# EAGLE design ELEKTRA-BENCH v0.1-20240103 (EAGLE 9.6.2)
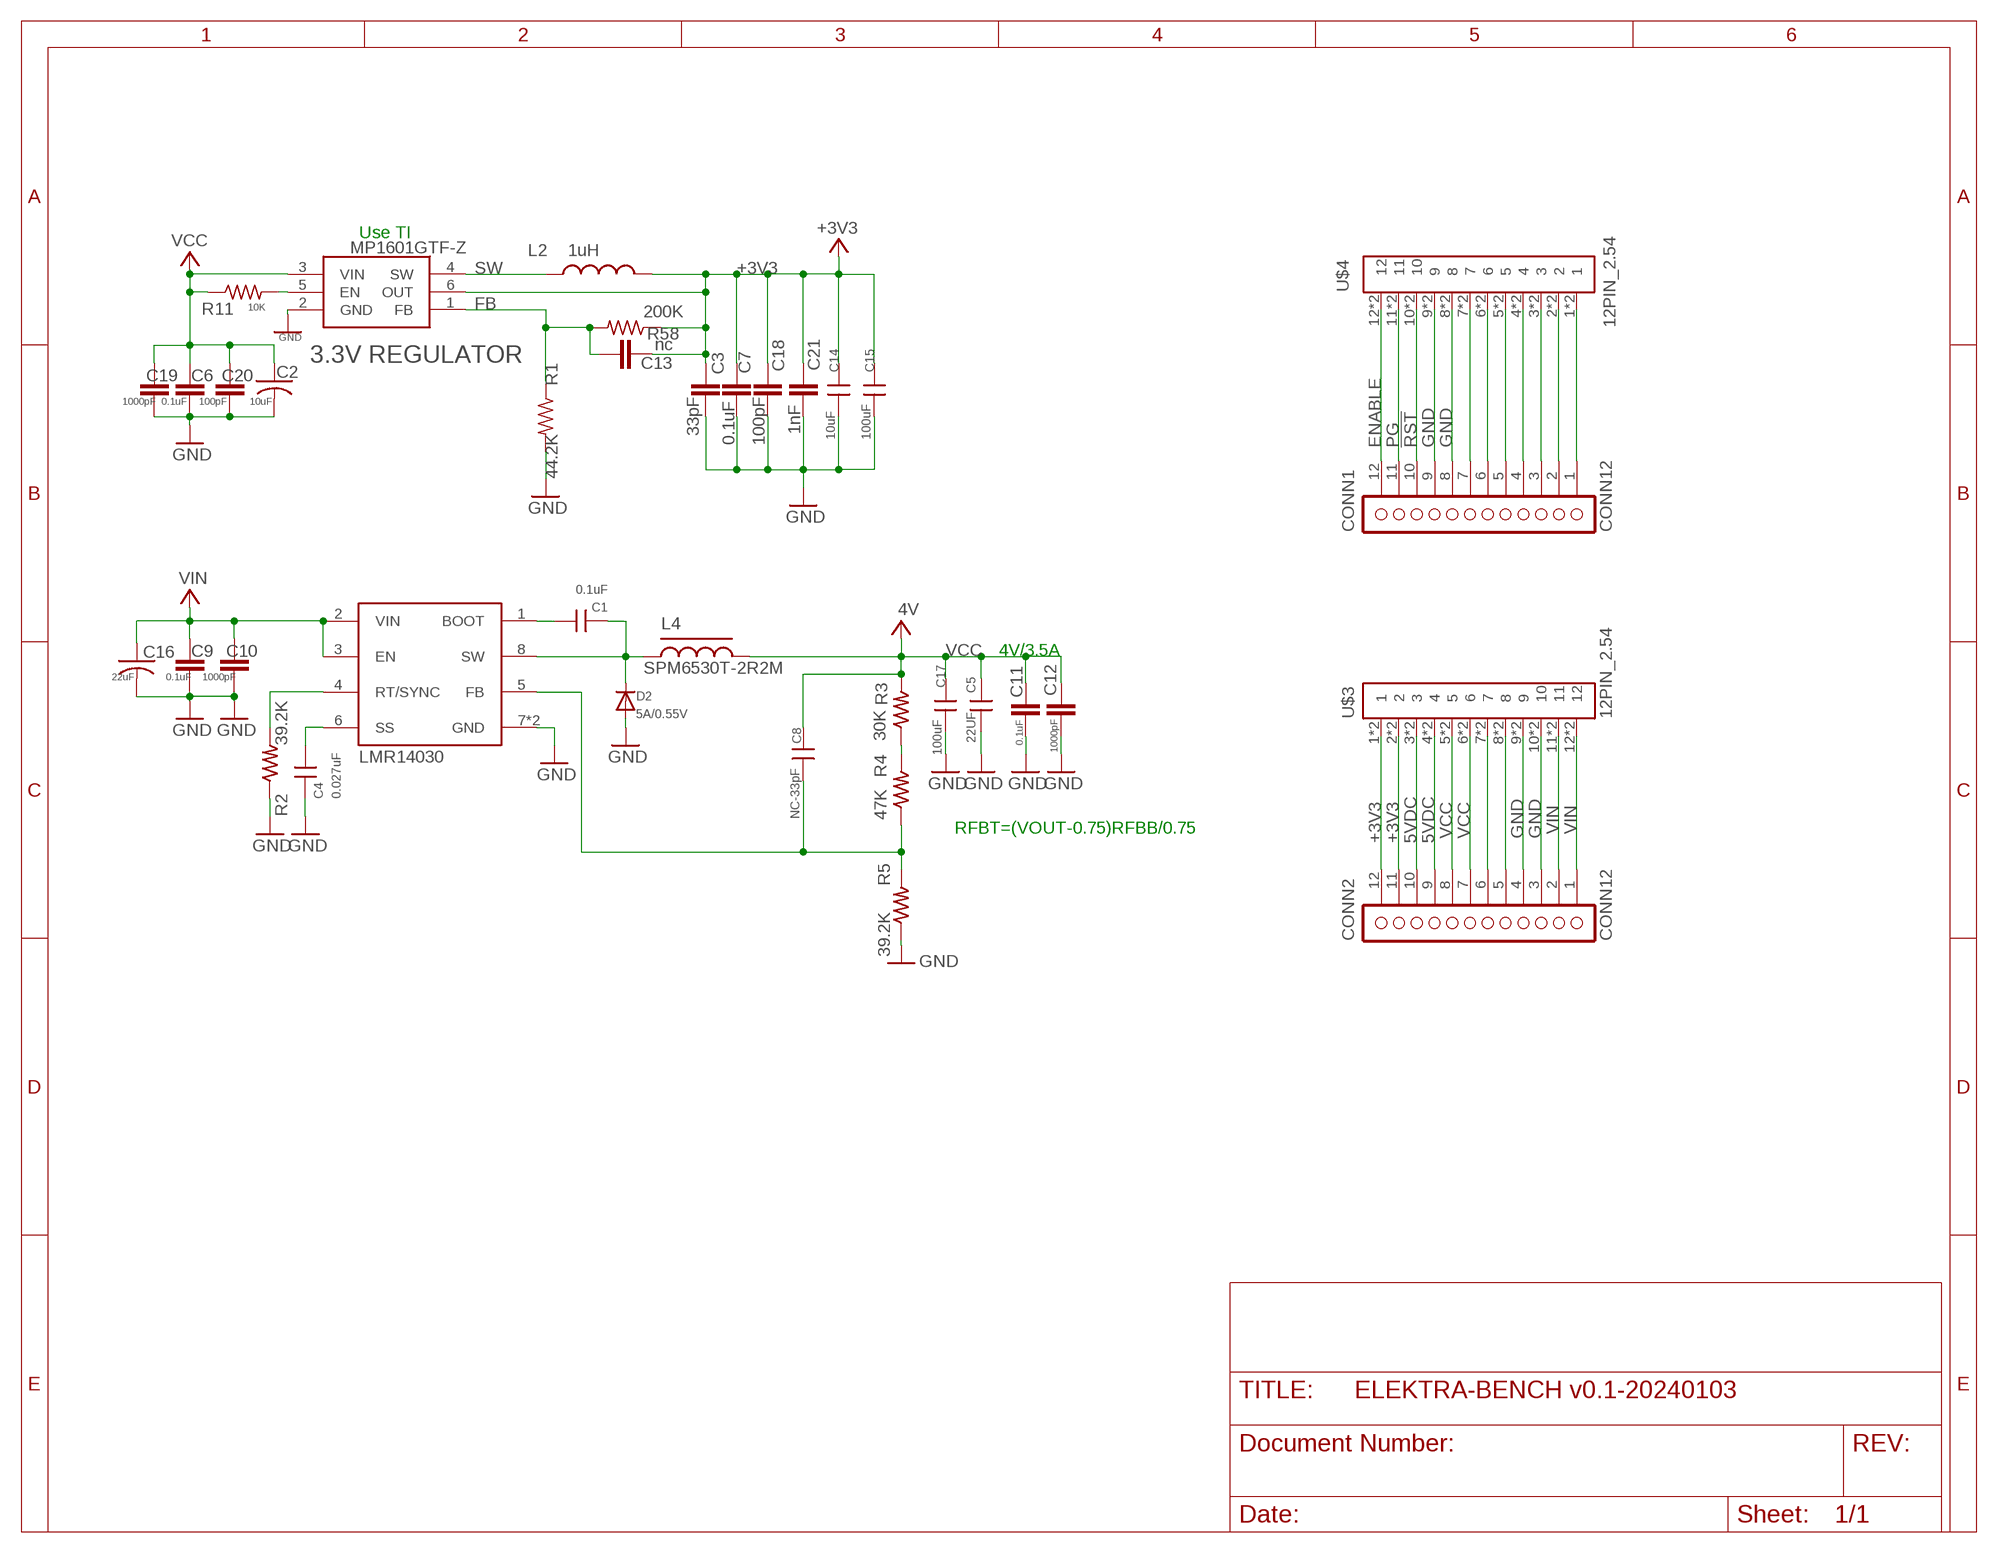
[diagram p0: schematic, sheet 1]

## Parts
C1  0.1uF  CAP0402A  [C0402]
C2  10uF  C-US0603  [C0603_B]
C3  33pF  CAP_1  [C0402_B]
C4  0.027uF  CAP0402A  [C0402]
C5  22UF  CAPC0805  [C0805]
C6  0.1uF  CAP_1  [C0402_B]
C7  0.1uF  CAP_1  [C0402_B]
C8  NC-33pF  CAP0402A  [C0402]
C9  0.1uF  CAP_1  [C0402_B]
C10  1000pF  CAP_1  [C0402_B]
C11  0.1uF  CAP_1  [C0402_B]
C12  1000pF  CAP_1  [C0402_B]
C13  nc  CAP_1  [C0402_B]
C14  10uF  CAPC0805  [C0805]
C15  100uF  CAPC1206  [C1206]
C16  22uF  C-US0603  [C0603_B]
C17  100uF  CAPC1206  [C1206]
C18  100pF  CAP_1  [C0402_B]
C19  1000pF  CAP_1  [C0402_B]
C20  100pF  CAP_1  [C0402_B]
C21  1nF  CAP_1  [C0402_B]
CONN1  CONN12  [1X12_SMD_STRAIGHT]
CONN2  CONN12  [1X12_SMD_STRAIGHT]
D2  5A/0.55V  DIODESMA  [SMADIODE]
L2  1uH  INDUCTOR-SPARKFUNVLS3012ET-4R7M  [INDUCTOR-VLS-E]
L4  SPM6530T-2R2M  INDUCTOR  [INDCUTOR_SPM6530]
R1  44.2K  R-US_  [R0402_B]
R2  39.2K  RES0402S  [R-0402S]
R3  30K  RES0402S  [R-0402S]
R4  47K  RES0402S  [R-0402S]
R5  39.2K  RES0402S  [R-0402S]
R11  10K  R-US_  [R0402_B]
R58  200K  R-US_  [R0402_B]
U2  LMR14030  [SO_POWERPAD_8]
U3  MP1601GTF-Z  [SOTFL50P160X60-6N]
U$3  12PIN_2.54  [12PIN_2.54]
U$4  12PIN_2.54  [12PIN_2.54]

## Nets
5VDC: CONN2.9 CONN2.10 U$3.3 U$3.4 U$3.P$3 U$3.P$4
!RST: CONN1.10 U$4.10 U$4.P$10
+3V3: C3.2 C7.2 C13.1 C14.1 C15.1 C18.2 C21.2 CONN2.11 CONN2.12 L2.P$2 R58.1 U3.6(OUT) U$3.1 U$3.2 U$3.P$1 U$3.P$2
ENABLE: CONN1.12 U$4.12 U$4.P$12
FB: C13.2 R1.1 R58.2 U3.1(FB)
GND: C2.2 C3.1 C4.2 C5.2 C6.1 C7.1 C9.1 C10.1 C11.1 C12.1 C14.2 C15.2 C16.2 C17.2 C18.1 C19.1 C20.1 C21.1 CONN1.8 CONN1.9 CONN2.3 CONN2.4 D2.A R1.2 R2.1 R5.1 U2.7(GND) U2.EP(GND) U3.2(GND) U$3.9 U$3.10 U$3.P$9 U$3.P$10 U$4.8 U$4.9 U$4.P$8 U$4.P$9
N$2: C8.1 R4.1 R5.2 U2.5(FB)
N$3: CONN1.7 U$4.7 U$4.P$7
N$4: CONN1.6 U$4.6 U$4.P$6
N$5: CONN1.5 U$4.5 U$4.P$5
N$6: CONN1.4 U$4.4 U$4.P$4
N$7: R11.2 U3.5(EN)
N$8: C4.1 U2.6(SS)
N$9: C1.2 D2.C L4.1 U2.8(SW)
N$10: C1.1 U2.1(BOOT)
N$11: R2.2 U2.4(RT/SYNC)
N$12: R3.1 R4.2
N$13: CONN1.3 U$4.3 U$4.P$3
N$14: CONN1.2 U$4.2 U$4.P$2
N$15: CONN1.1 U$4.1 U$4.P$1
N$20: CONN2.6 U$3.7 U$3.P$7
N$21: CONN2.5 U$3.8 U$3.P$8
PG: CONN1.11 U$4.11 U$4.P$11
SW: L2.P$1 U3.4(SW)
VCC: C2.1 C5.1 C6.2 C8.2 C11.2 C12.2 C17.1 C19.2 C20.2 CONN2.7 CONN2.8 L4.2 R3.2 R11.1 U3.3(VIN) U$3.5 U$3.6 U$3.P$5 U$3.P$6 ; supply symbol labelled 4V
VIN: C9.2 C10.2 C16.1 CONN2.1 CONN2.2 U2.2(VIN) U2.3(EN) U$3.11 U$3.12 U$3.P$11 U$3.P$12

## Notes on the sheet
- Use TI
- 3.3V REGULATOR
- 4V/3.5A
- RFBT=(VOUT-0.75)RFBB/0.75

## Library data of the parts
C1 C4 C5 C8 C14 C15 C17 = particle SZ:CAP: CAP
C2 C16 = Bretts-Spark-Library:C-US: Capacitor
C3 C6 C7 C9-C13 C18-C21 = Particle:CAP_1
CONN1 CONN2 = particle-studios:CONN12
D2 = particle-studios:DIODE: Diode SMADIODE - SMA Surface Mount Package 20V 1A Schottky Diode Digikey: 641-1014-6-ND DO-1N4148 - Through Hole Small Current Diode SOD-123 20V 1 A (.5mV Vf) Schottky Diode - Digikey: MBRX120TPMSCT-ND SOD-323 10V 570mA (.38mV Vf, 3ns) Schottky Diode - Digikey: ZLLS410CT-ND SOD-523 30V 30mA Schottky Diode (RB751S-40TE61) - Digikey: RB751S-40TE61CT-ND SOT23-R/W - SOT23 Package (R = Solder Paste/Reflow Ovens, W = Hand-Soldering) BAT54Film 40V 300mA - Digikey: 497-7162-1-ND
L2 = Particle:INDUCTOR-SPARKFUN: Inductors Basic Inductor/Choke - 0603 and 1206. Footprints are not proven and vary greatly between part numbers. SRN6045- 33uH, 20% 1.4A
L4 = particle-studios:INDUCTOR
R1 R58 = Particle:R-US_: 0402 Resistor
R2-R5 = particle SZ:RES: RES
R11 = Spark:R-US_: 0402 Resistor
U2 = particle-studios:LMR14030
U3 = MP1601GTF-Z:MP1601GTF-Z: Conv DC-DC Single Step Down 2.3V to 5.5V 6-Pin SOT-563 T/R - Tape and Reel Source: Datasheet <https://www.monolithicpower.com/en/documentview/productdocument/index/version/2/document_type/Datasheet/lang/en/sku/MP1601/document_id/1038/>; DESCRIPTION: Conv DC-DC Single Step Down 2.3V to 5.5V 6-Pin SOT-563 T/R - Tape and Reel; HEIGHT: 0.6mm; MANUFACTURER_NAME: Monolithic Power Systems (MPS); MANUFACTURER_PART_NUMBER: MP1601GTF-Z
U$3 U$4 = particle SZ:12PIN_2.54

## Net classes
0 default: width 0.152 mm, clearance 0.152 mm
1 power: width 0.254 mm, drill 0.61 mm, clearance 0.203 mm
3 BAT: clearance 0.203 mm
4 3V3: width 0.305 mm, clearance 0.508 mm
6 +3V3: width 0.203 mm, clearance 0.152 mm

## Board
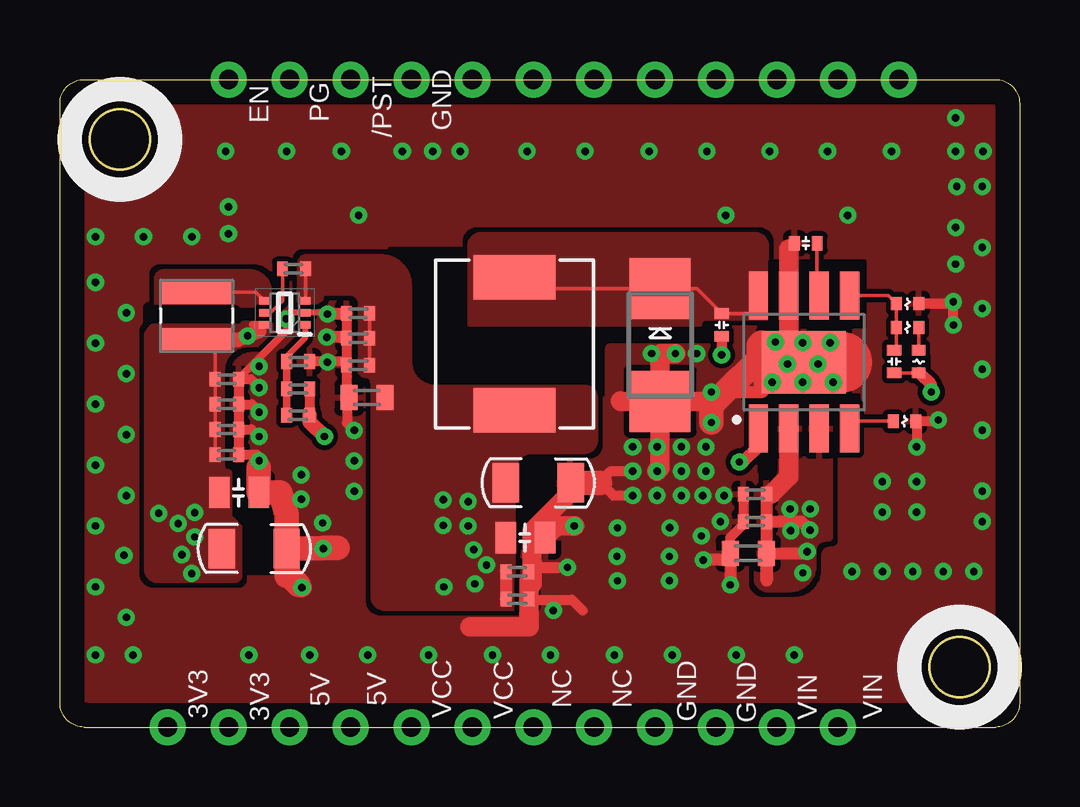
[diagram p1: board, top side]
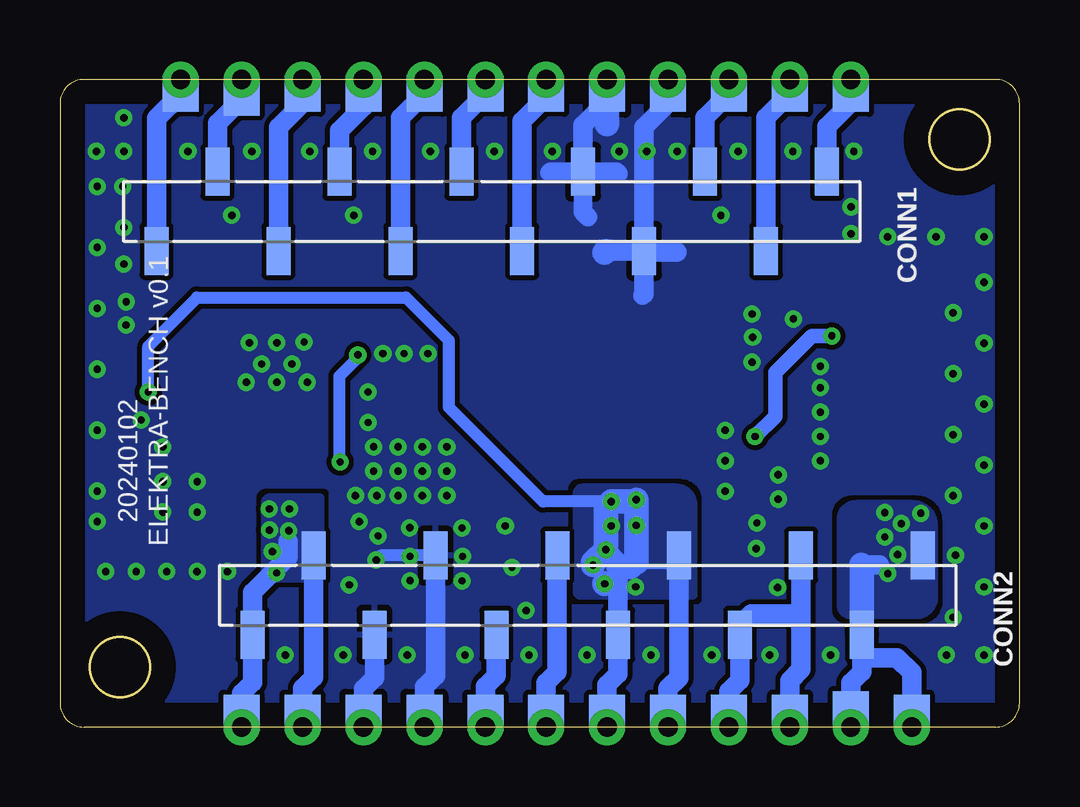
[diagram p2: board, bottom side, seen from below]

Size 40 x 27 mm. Coordinates in mm from the lower left corner, seen from the top.
Outline: 1,0 39,0 arc90 40,1 40,26 arc90 39,27 1,27 arc90 0,26 0,1 arc90 1,0
Outline: circle at 2.5,24.5 radius 1.25
Outline: circle at 37.5,2.5 radius 1.25
Copper layers (1*16): Top 0.035mm / dielectric 1.5mm / Bottom 0.035mm
Design rules "default *": minimum track width 6mil, minimum drill 12mil, track to track 8mil, track to pad 6mil, pad to pad 6mil, via to via 6mil, smd to smd 6mil, copper to edge 40mil, drill to drill 6mil, minimum pad ring 10mil, minimum via ring 8mil, stop-mask expansion 4mil, vias tented up to drill 20mil, thermal gap 10mil

### Footprints (pad centres in the part's own frame; a part is rotated, then mirrored left to right if it is on the bottom)
C0402 = smd 0.45 x 0.6: 1 -0.47,0; 2 0.47,0
C0603_B = smd 0.711 x 1.041: 1 -0.749,0; 2 0.749,0
C0402_B = smd 0.457 x 0.61: 1 -0.483,0; 2 0.483,0
C0805 = smd 0.85 x 1.3: 1 -0.8,0; 2 0.85,0
C1206 = smd 1.1 x 1.65: 1 -1.35,0; 2 1.35,0
1X12_SMD_STRAIGHT = smd 1 x 2: 1 13.97,1.65; 2 11.43,-1.65; 3 8.89,1.65; 4 6.35,-1.65; 5 3.81,1.65; 6 1.27,-1.65; 7 -1.27,1.65; 8 -3.81,-1.65; 9 -6.35,1.65; 10 -8.89,-1.65; 11 -11.43,1.65; 12 -13.97,-1.65
SMADIODE = smd 2.54 x 2.54: A 2.349,0; C -2.349,0
INDUCTOR-VLS-E = smd 1 x 3: P$1 -1,0; P$2 1,0
INDCUTOR_SPM6530 = smd 1.85 x 3.4: 1 -2.775,0; 2 2.775,0
R0402_B = smd 0.457 x 0.61: 1 -0.483,0; 2 0.483,0
R-0402S = smd 0.45 x 0.55: 1 -0.47,0; 2 0.47,0
SO_POWERPAD_8 = smd 0.8 x 2: 1 -1.905,-2.775; 2 -0.635,-2.775; 3 0.635,-2.775; 4 1.905,-2.775; 5 1.905,2.775; 6 0.635,2.775; 7 -0.635,2.775; 8 -1.905,2.775 | smd 3.5 x 2.6: EP 0,0
SOTFL50P160X60-6N = smd 0.475 x 0.3: 1 -0.838,0.5; 2 -0.838,0; 3 -0.838,-0.5; 4 0.838,-0.5; 5 0.838,0; 6 0.838,0.5
12PIN_2.54 = drill 0.8 pad 1.5: 1 -13.97,0; 2 -11.43,0; 3 -8.89,0; 4 -6.35,0; 5 -3.81,0; 6 -1.27,0; 7 1.27,0; 8 3.81,0; 9 6.35,0; 10 8.89,0; 11 11.43,0; 12 13.97,0 | smd 1.5 x 1.5 bottom: P$1 -13.97,0.6; P$2 -11.43,0.75; P$3 -8.89,0.6; P$4 -6.35,0.6; P$5 -3.81,0.6; P$6 -1.27,0.6; P$7 1.27,0.6; P$8 3.81,0.6; P$9 6.35,0.6; P$10 8.89,0.6; P$11 11.43,0.6; P$12 13.97,0.6

### Placement (x,y rotation side)
C1  27.58,16.76 90 top
C2  12.8,13.74 180 top
C3  6.96,12.41 180 top
C4  31.09,20.17 180 top
C5  19.38,7.9 0 top
C6  12.42,15.09 0 top
C7  6.96,14.5 180 top
C8  34.77,15.24 270 top
C9  28.97,8.57 0 top
C10  28.97,9.71 0 top
C11  19.08,6.48 180 top
C12  19.08,5.33 180 top
C13  9.93,13 180 top
C14  7.44,9.78 0 top
C15  8.1,7.44 0 top
C16  28.69,7.25 180 top
C17  19.94,10.19 0 top
C18  6.96,13.46 180 top
C19  12.42,17.25 0 top
C20  12.42,16.21 0 top
C21  6.96,11.36 180 top
CONN1  22,21.5 180 bottom
CONN2  18,5.5 180 bottom
D2  25.02,15.93 270 top
L2  5.69,17.14 270 top
L4  18.95,15.98 270 top
R1  9.93,15.24 0 top
R2  12K  [R-0402S]  35.2,12.75 180 top
R3  82K  [R-0402S]  35.79,15.24 270 top
R4  82K  [R-0402S]  35.33,16.66 0 top
R5  35.33,17.65 180 top
R11  9.75,19.1 180 top
R58  9.93,14.1 180 top
U2  31.01,15.21 0 top
U3  9.37,17.27 180 top
U$3  18.46,0 0 top
U$4  21,27 180 top

### Tracks (layer width: path | path; a pad name or v marks a point on that pad's centre or on a via)
5VDC
  Bottom 0.813: CONN2.10 9.11,4.78 | 9.11,4.78 9.11,2.4 9.57,1.94 U$3.P$3 U$3.3 | 9.11,4.78 9.16,4.73 11.18,4.73 11.65,4.26 CONN2.9 11.65,1.95 12.11,1.49 U$3.P$4 U$3.4
!RST
  Bottom 0.813: CONN1.10 13.11,25.4 U$4.P$10 U$4.10
+3V3  (via drill 0.3 pad 0.6)
  Top 0.152: L2.P$2 6.48,16.14 C7.2 C18.2 C3.2 C21.2 6.51,11.32
  Top 0.305: U3.6 8.03,16.77 8.3,16.51
  Top 0.406: R58.1 C13.1
  Top 0.61: C13.1 10.41,12.72 v11.02,12.12 | L2.P$2 7.41,16.14 8.3,16.51
  Bottom 0.61: v7.82,16.31 8.66,16.31 10.19,14.78 10.19,12.95 v11.02,12.12
  Bottom 0.813: 6.6,6.76 5.84,6.76 | 6.57,2.9 6.57,2.29 7.03,1.83 U$3.2 U$3.P$2 | 6.57,2.9 CONN2.11 | 6.57,2.9 5.11,2.9 4.49,2.28 U$3.P$1 U$3.1
  Bottom 1.016: 6.6,6.76 6.57,6.74 CONN2.11
  other vias: 5.08,7.19 5.49,6.4 5.61,7.92 4.11,8.92 4.93,8.48 5.61,8.94
  pour Bottom (no thermals): 4.45,9.4 6.83,9.4 arc-90 7.57,8.66 7.57,5.08 arc-90 7.06,4.57 6.35,4.57 arc-90 6.35,4.57 4.3,4.57 arc-90 3.45,5.41 3.45,8.41 arc-90
  pour Top (no thermals): 8.74,16.87 7.59,16.87 arc90 7.49,16.76 4.01,16.76 arc90 3.56,16.31 3.56,6.58 arc90 4.06,6.07 7.29,6.07 arc90 7.54,6.32 7.54,8.81 arc90 7.29,9.07 arc-90 7.16,9.19 7.16,10.54 arc90 7.01,10.69 arc-90 6.83,10.87 6.83,14.88 arc-90 7.85,15.9 8.41,15.9 arc90 8.84,16.33 8.84,16.76 arc90
ENABLE
  Bottom 0.813: CONN1.12 8.03,25.04 7.03,26.04 U$4.P$12 U$4.12
FB
  Top 0.152: 9.45,15.45 R1.1
  Top 0.254: U3.1 10.21,16.21 9.45,15.45
  Top 0.305: R1.1 R58.2 C13.2
GND  (via drill 0.3 pad 0.6)
  Top 0.152: v36.61,12.8 36.56,12.75 36.35,12.75 | 28.49,8.67 C9.1 | C11.1 19.56,6.1 19.68,5.97 | 7.44,12.57 C3.1 | 7.44,11.56 C21.1 | C19.1 11.94,16.92 | 11.94,16.92 11.94,16.26 C20.1 | 9.61,17.21 9.53,16.51 9.42,16.51 8.22,15.3 | 30.38,16.51 30.38,15.75 30.91,15.21 U2.EP | 11.12,17.27 11.58,17.27 11.94,16.92 | 8.29,10.51 C14.2 | C5.2 20.23,8.19
  Top 0.254: 9.68,17.27 U3.2 11.1,17.27 v11.15,17.22
  Top 0.305: 9.42,16.51 8.31,15.39 v8.31,15.04 | C19.1 11.91,17.27 11.12,17.27 | C20.1 11.89,16.26 11.71,16.26 | 9.68,17.27 9.61,17.21 | C7.1 7.44,14.53 8.22,15.3
  Top 0.406: C10.1 28.49,8.67 | C16.2 27.94,7.9 28.49,8.45 C9.1 | R5.1 | v37.24,17.73 37.24,17.69 37.2,17.65 R5.1 | 36.35,12.75 R2.1 35.71,12.71 v35.71,11.68 | v8.31,14.15 7.95,14.5 C7.1 C18.1 | C18.1 7.44,12.57 | 7.44,11.56 C3.1 7.98,12.41 8.27,12.12 v8.31,12.12 | C21.1 8.21,11.36 8.28,10.82 | C18.1 8,13.46 8.31,13.15 v8.31,13.13 | C19.1 11.94,16.26 | C20.1 C6.1 | C6.1 11.94,13.82 12.01,13.74 C2.2 11.96,13.65 11.96,12.68 v12.27,12.37 | C6.1 11.79,15.24 R1.2 | C12.1 19.58,5.31 21.34,5.31 21.79,4.86 | v23.88,10.67 22.97,10.67 22.5,10.21 22.5,10.19 22.53,10.19 23.07,9.65 v23.88,9.65 | R5.1 37.25,17.65 v37.25,16.76 | 20.75,6.66 v21.16,6.66
  Top 0.457: 20.75,6.66 19.74,6.66 C11.1
  Top 0.508: C2.2 12,13.79 | C19.1 11.91,17.22 v11.15,17.22 | 11.71,16.26 v11.12,16.26 | 29.23,16.03 29.16,16.03 29.16,14.3 | U2.EP 30.94,15.14 | v27.15,13.97 29.29,13.97 v29.69,14.38 | 30.38,19.93 C4.2 | v26.82,6.96 27.66,6.96 C16.2 27.94,5.97 | D2.A 25.02,11.81 v24.89,11.68
  Top 0.813: 30.38,16.51 U2.7 30.38,19.93 | D2.A 25.02,15.54 25.04,15.57 v25.65,15.57 | v21.44,8.38 20.71,8.38 C5.2 | C17.2 21.29,9.78 19.68,8.18 19.68,5.97 | 19.56,6.1 C12.1 19.56,4.17 17.09,4.17 | 28.35,14.55 28.3,14.55 | 9.45,6.3 9.6,6.3 v10.08,5.82 | D2.A 26.99,13.58 27.15,13.41 | D2.A 25.02,10.79 v24.89,10.67 | D2.A 23.38,13.58 23.37,13.59
  Top 1.016: 8.28,10.82 8.28,9.79 C14.2 9.17,9.78 9.45,8.89 C15.2 | C15.2 10.95,7.44 10.97,7.47 11.58,7.47 | C15.2 9.45,6.43 | 9.45,6.43 9.45,6.3 | 9.45,6.43 9.96,5.92 | C17.2 22.5,10.19 | 29.13,15.34 28.35,14.55 | 29.13,15.34 29.13,15.93 29.23,16.03 30.05,15.21 U2.EP 29.13,15.21 29.13,15.34 | 28.3,14.55 27.15,13.41 v27.15,12.7
  Top 2.54: U2.EP 32.59,15.21
  Bottom 0.508: 27.49,8.53 v27.53,8.56 | v26.82,6.96 26.63,7.15 CONN2.4
  Bottom 0.762: 15.65,18.06 15.72,17.98 | CONN1.8 18.19,21.47 17.98,21.26 | CONN1.8 18.1,23.06 16.71,23.06 16.8,23.15 CONN1.8 | CONN1.8 19.55,23.15 19.58,23.11
  Bottom 0.813: CONN1.9 15.67,19.87 15.67,25 14.65,26.02 U$4.P$9 U$4.9 | CONN2.4 24.35,2.14 24.81,1.68 U$3.9 | U$3.10 U$3.P$10 27.35,1.6 26.89,2.06 CONN2.3 | U$4.8 U$4.P$8 17.19,26.09 18.19,25.09 CONN1.8 | 15.61,19.81 14.28,19.81 | CONN1.9 17.23,19.85 | CONN1.9 15.65,18.06
  Bottom 1.016: U$4.P$8 17.19,25.14 | CONN1.9 15.61,19.81 | 17.23,19.85 17.3,19.79
  other vias: 25.91,11.68 11.15,15.21 8.31,11.1 10.06,10.52 24.66,15.57 26.54,15.57 26.92,11.68 29.82,16.05 30.96,16.03 32.11,16.03 30.33,15.14 31.6,15.14 30.96,14.38 32.23,14.38 1.48,18.54 2.77,17.27 1.48,16 2.77,14.73 1.48,13.46 2.77,12.19 1.48,10.92 2.77,9.65 1.48,8.38 2.67,7.16 1.48,5.84 2.77,4.57 1.48,3 29.59,24 37.34,25.4 37.34,24 23.88,11.68 12.45,21.34 27.76,21.34 32.84,21.34 37.34,19.3 24.89,9.65 25.91,10.67 26.92,10.67 25.91,9.65 27.69,9.65 23.24,8.31 12.27,11.1 12.27,9.83 10.06,9.5 10.97,7.44 37.34,20.83 9.42,17.02 23.22,7.11 25.4,7.12 1.48,20.44 3.48,20.44 5.5,20.44 37.38,22.54 38.45,22.54 3.05,3 38.45,20 38.45,17.46 38.45,14.92 38.45,12.38 38.45,9.84 33.02,6.48 35.56,6.48 34.29,6.48 36.83,6.48 38.1,6.48 38.45,8.57 34.28,10.23 35.71,10.23 35.71,8.96 34.28,8.96 25.42,8.31 23.24,6.1 20.57,4.86 6.9,24 7.02,21.69 7.02,20.57 38.48,24 9.44,24 11.73,24 14.27,24 16.68,24 19.48,24 21.89,24 15.54,24 24.56,24 26.97,24 32,24 34.67,24 7.87,3 10.41,3 12.83,3 15.37,3 18.03,3 20.45,3 23.11,3 25.53,3 28.19,3 30.61,3 26.8,9.65 26.74,7.97 25.4,6.1 10.95,8.51 27.94,5.92
  pour Bottom (rank 4): -3.54,27.56 42.42,27.56 42.42,-1.27 -3.54,-1.27
  pour Top (rank 4): -4.52,29.08 45.59,29.08 45.59,-2.92 -4.52,-2.92
  cutout Top: 13.74,19.94 16.79,19.94 16.79,16.89 arc90 17.17,16.51 23.14,16.51 arc90 22.63,16 22.63,13.84 arc90 22.12,14.35 15.77,14.35 arc-90 14.88,15.24 14.88,18.8 arc90
  cutout Top: 3.84,17.53 7.26,17.53 arc-90 7.52,17.27 7.52,17.02 arc-90 7.39,16.89 3.84,16.89 arc90 3.53,16.59 3.53,17.48 arc-90 3.71,17.65 arc90
  cutout Top: 34.44,15.49 36.22,15.49 36.22,14.99 34.44,14.99
  cutout Top: 33.55,19.43 33.55,16.69 29.59,16.69 29.59,19.43
  cutout Top: 28.47,13.84 33.3,13.84 33.3,13.64 28.47,13.64
  cutout Top: 22.63,15.14 arc90 22.66,15.16 22.66,15.77 arc-90 22.94,16.05 27.13,16.05 arc-90 27.23,15.95 27.23,16.33 arc-90 27.25,16.36 22.33,16.36 arc90 22.3,16.33 22.3,15.21 22.63,15.21
  cutout Top: 19.53,11.13 20.6,11.13 20.62,11.15 20.62,8.76 20.6,8.74 19.86,8.74 19.86,7.49 19.84,7.47 19.25,7.47 19.25,10.85
  cutout Top: 28.34,8.59 28.34,6.79 28.97,6.79 28.97,8.59
  cutout Top: 29.13,10.64 29.82,10.64 29.82,11.2 29.24,11.2 arc90 29.13,11.1
  cutout Top (no thermals): 7.62,11 7.87,10.74 7.87,9.14 8.56,9.14 8.92,8.79 8.92,6.38 7.77,6.38 7.75,6.4 7.75,8.31 7.24,8.81 7.24,10.72 7.04,10.92 7.26,10.97
N$2
  Top 0.152: U2.5 34.52,17.99 R5.2 R4.1 34.86,15.8 C8.1
N$3
  Bottom 0.813: U$4.7 U$4.P$7 19.73,26.26 20.73,25.26 CONN1.7
N$4
  Bottom 0.813: CONN1.6 23.27,25.4 U$4.P$6 U$4.6
N$5
  Bottom 0.813: CONN1.5 25.81,25.4 U$4.P$5 U$4.5
N$6
  Bottom 0.813: U$4.4 U$4.P$4 27.35,25.86 28.35,24.86 CONN1.4
N$7
  Top 0.152: R11.2 9.27,17.75 8.79,17.27 U3.5
N$8
  Top 0.152: U2.6 31.56,18.08 C4.1
N$9
  Top 0.152: U2.8 29.11,17.23 C1.2 26.54,18.27 D2.C 19.43,18.27 L4.1
  pour Top (no thermals): 17.04,20.07 17.04,16.76 26.7,16.76 arc-90 26.95,17.02 29.49,17.02 29.49,20.07 arc90 28.98,20.57 17.55,20.57 arc90
N$10  (via drill 0.3 pad 0.6)
  Top 0.432: C1.1 v27.58,15.52
  Top 0.508: U2.1 29.11,11.68 28.47,11.05 v28.32,11.05
  Bottom 0.508: v27.58,15.52 27.58,15.39 28.35,14.63 28.35,11.07 v28.32,11.05
N$11
  Top 0.152: U2.4 32.92,12.46 33.21,12.75 R2.2
N$12
  Top 0.152: R4.2 35.8,15.72 R3.1
N$13
  Bottom 0.813: CONN1.3 30.89,25.02 29.89,26.02 U$4.P$3 U$4.3
N$14
  Bottom 0.813: CONN1.2 33.43,25.19 32.43,26.19 U$4.2 U$4.P$2
N$15
  Bottom 0.813: CONN1.1 35.97,22.15 35.96,22.16 35.96,25.38 34.97,26.37 U$4.P$1 U$4.1
N$20
  Bottom 0.813: CONN2.6 19.27,2.29 19.73,1.83 19.73,1.27 U$3.P$7 U$3.7
N$21
  Bottom 0.813: CONN2.5 21.82,2.14 22.27,1.69 22.27,1.02 U$3.P$8 U$3.8
PG
  Bottom 0.813: CONN1.11 10.57,25.4 U$4.P$11 U$4.11
SW
  Top 0.152: L2.P$1 8.16,18.14 U3.4
  pour Top (no thermals): 3.96,17.65 3.96,18.67 arc-90 4.34,19.05 7.9,19.05 arc-90 8.79,18.16 8.79,17.78 arc-90 8.53,17.53 4.09,17.53 arc-90
VCC  (via drill 0.3 pad 0.6)
  Top 0.152: C8.2 R3.2 | R11.1 10.24,17.8 U3.3 | C19.2 C20.2 C6.2
  Top 0.508: v36.32,13.97 36.32,14.28 35.83,14.77 R3.2 | C11.2 C12.2
  Bottom 0.152: 16.18,7.42 16.18,6.66 14.2,6.65 CONN2.8
  Bottom 0.508: v36.32,13.97 36.32,15.88 34.29,17.91 25.58,17.91 23.8,16.13 23.8,13.34 19.86,9.4 v17.02,9.4
  Bottom 0.813: U$3.5 U$3.P$5 14.65,1.61 14.2,2.06 14.2,6.65 | U$3.6 U$3.P$6 17.19,1.75 16.73,2.21 CONN2.7 16.73,6.88 v17.25,7.39
  Bottom 1.016: 17.3,5.99 v17.3,5.97 | 16.71,6.68 16.22,6.68 | 15.98,6.86 v15.98,9.47 16.05,9.4 v17.02,9.4 17.25,9.17 v17.25,7.39 17.78,6.86 v17.78,6.76
  other vias: 15.98,8.41 17.02,8.38 16,5.84
  pour Top (no thermals): 9.93,19.3 9.93,17.78 arc90 10.06,17.65 10.69,17.65 arc90 10.95,17.91 arc-90 11.07,18.03 12.09,18.03 arc-90 12.47,17.65 12.47,14.86 arc90 12.73,14.61 arc-90 12.98,14.35 12.98,5.49 arc90 13.59,4.88 18.85,4.88 arc90 18.95,4.98 18.95,10.67 arc-90 19.71,11.43 21.87,11.43 arc90 22.38,11.94 22.38,13.72 arc90 21.87,14.22 15.65,14.22 arc-90 14.63,15.24 14.63,18.41 arc90 13.36,19.68 10.31,19.68 arc90
  pour Bottom (no thermals): 14.3,10.08 18.21,10.08 arc-90 18.57,9.73 18.57,5.64 arc-90 18.31,5.38 13.61,5.38 arc-90 13.49,5.51 13.49,9.27 arc-90
VIN  (via drill 0.3 pad 0.6)
  Top 0.152: 29.45,9.65 C9.2 29.45,7.26
  Top 0.508: C10.2 29.45,9.65 29.45,7.26 | 29.45,7.26 C16.1 | C9.2 30.91,8.57 v31.27,8.21 | C16.1 31.08,7.25 v31.15,7.32 | C16.1 29.46,7.22 29.46,6.1 29.45,6.11 29.45,7.26
  Top 0.813: U2.2 30.38,10.44 29.65,9.71
  Bottom 0.813: U$3.P$12 U$3.12 32.43,1.4 31.97,1.86 CONN2.1 31.97,5.61 30.49,7.09 30.49,7.75 | CONN2.2 29.43,2.08 29.89,1.62 U$3.P$11 U$3.11
  other vias: 30.46,8.18 30.97,6.43 30.44,9.1 31.27,9.1
  pour Bottom (no thermals): 29.18,9.68 31.25,9.68 arc-90 31.57,9.35 31.57,6.1 29.49,6.1 arc-90 29.02,6.56 29.02,9.52 arc-90
  pour Top: 30.02,13.41 30.76,13.41 arc-90 30.86,13.31 30.86,11.35 arc90 30.96,11.25 31.19,11.25 arc90 31.27,11.33 31.27,13.28 arc-90 31.37,13.39 32,13.39 arc-90 32.16,13.23 32.16,7.87 32.05,7.77 31.9,7.77 arc90 31.47,7.34 31.47,6.73 arc-90 30.4,5.66 29.51,5.66 arc-90 28.98,6.2 28.98,9.8 arc-90 29.41,10.24 29.46,10.24 arc90 30,10.77 30,13.39 arc-90

### Text on the board
tPlace: EN | PG | /PST | GND | 5V | 5V | NC | NC | 3V3 | 3V3 | VCC | VCC | GND | GND | VIN | VIN
bPlace: ELEKTRA-BENCH v0.1 | 20240102